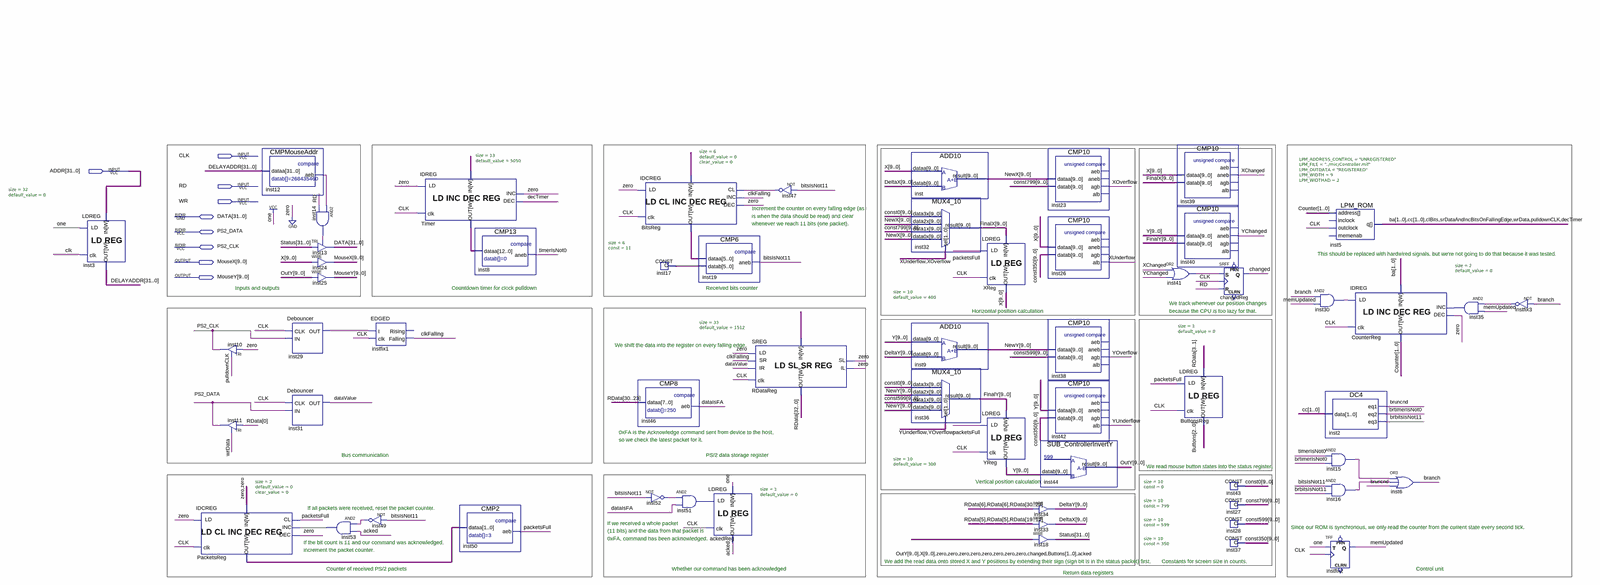
[diagram p0: schematic sheet, whole]
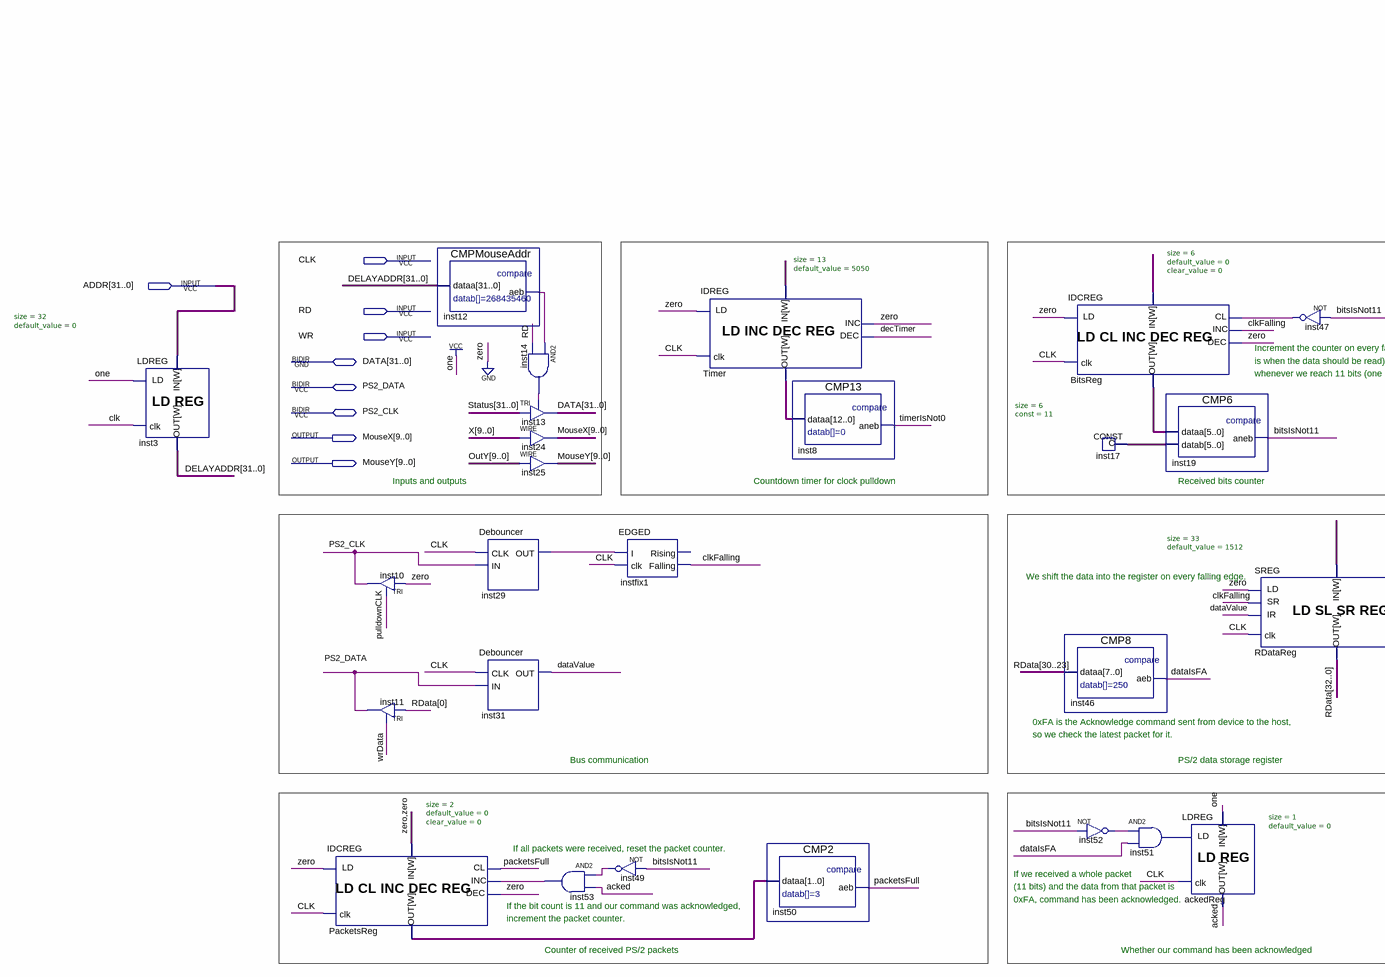
[diagram p1: schematic sheet, left part]
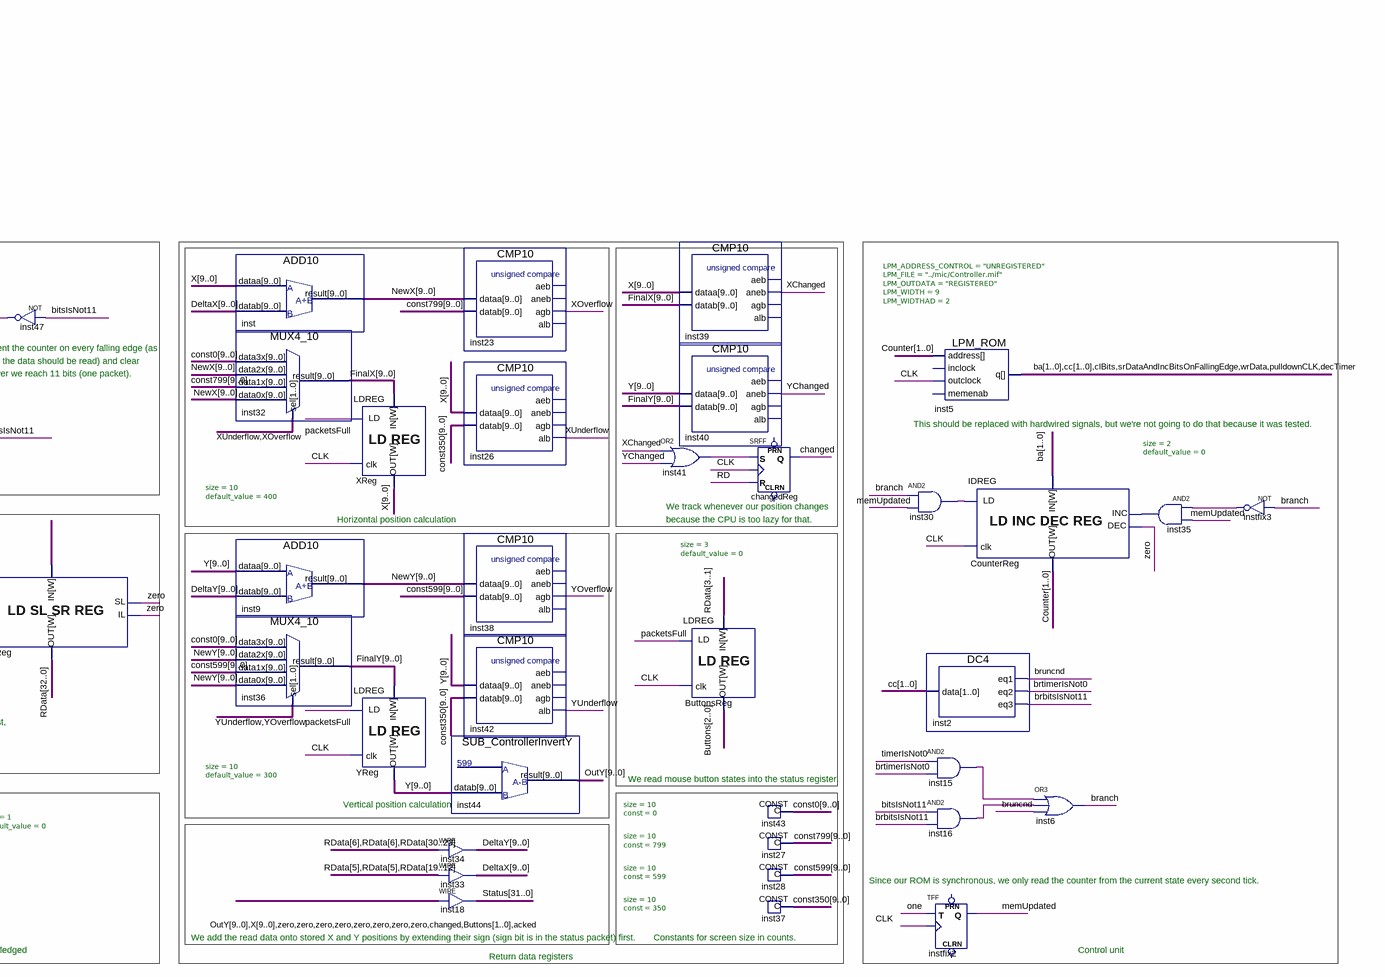
[diagram p2: schematic sheet, right part]
// Quartus schematic Controller.bdf as structural Verilog: 59 symbols, 9 pins
module Controller (
  input  CLK,
  input  [31:0] ADDR,
  input  RD,
  input  WR,
  inout  [31:0] DATA,
  inout  PS2_DATA,
  inout  PS2_CLK,
  output [9:0] MouseX,
  output [9:0] MouseY
);

  wire acked, bitsIsNot11, branch, brbitsIsNot11, brtimerIsNot0, bruncnd, changed, clBits, clkFalling,
       dataIsFA, dataValue, decTimer, inst12_aeb, inst14_out, inst15_out, inst16_out, inst29_o, inst30_out,
       inst35_out, inst41_out, inst47_out, inst49_out, inst51_out, inst52_out, inst53_out, instfix3_out,
       memUpdated, packetsFull, pulldownCLK, srDataAndIncBitsOnFallingEdge, timerIsNot0, wrData, XChanged,
       XOverflow, XUnderflow, YChanged, YOverflow, YUnderflow;
  wire [1:0] ba, cc, Counter, PacketsReg_data_out;
  wire [2:0] Buttons;
  wire [5:0] BitsReg_data_out, inst17_data;
  wire [9:0] const0, const350, const599, const799, DeltaX, DeltaY, FinalX, FinalY, NewX, NewY, OutY, X, Y;
  wire [12:0] Timer_data_out;
  wire [31:0] DELAYADDR, Status;
  wire [32:0] RData;

  LDREG #(.size(32), .default_value(0)) inst3 (.clk(CLK), .data_in(ADDR), .ld(1'b1), .data_out(DELAYADDR));
  IDCREG #(.size(2), .default_value(0), .clear_value(0)) PacketsReg (
    .clk(CLK), .data_in(2'b00), .cl(packetsFull), .inc(inst53_out), .dec(1'b0), .ld(1'b0),
    .data_out(PacketsReg_data_out));
  TRI inst10 (.IN(1'b0), .OE(pulldownCLK), .OUT(PS2_CLK));
  TRI inst11 (.IN(RData[0]), .OE(wrData), .OUT(PS2_DATA));
  CMPMouseAddr inst12 (.dataa(DELAYADDR), .aeb(inst12_aeb));
  Debouncer inst29 (.CLK(CLK), .I(PS2_CLK), .O(inst29_o));
  Debouncer inst31 (.CLK(CLK), .I(PS2_DATA), .O(dataValue));
  and inst14 (inst14_out, inst12_aeb, RD);
  TRI inst13[31:0] (.IN(Status), .OE(inst14_out), .OUT(DATA));
  assign MouseX = X;  // WIRE inst24
  assign MouseY = OutY;  // WIRE inst25
  and inst53 (inst53_out, inst49_out, acked);
  not inst49 (inst49_out, bitsIsNot11);
  EDGED instfix1 (.I(inst29_o), .clk(CLK), .Falling(clkFalling));  // open: Rising
  IDREG #(.size(13), .default_value(5050)) Timer (
    .clk(CLK), .data_in({13{1'b0}}), .inc(1'b0), .dec(decTimer), .ld(1'b0), .data_out(Timer_data_out));
  CMP13 inst8 (.dataa(Timer_data_out), .aneb(timerIsNot0));
  CMP2 inst50 (.dataa(PacketsReg_data_out), .aeb(packetsFull));
  IDCREG #(.size(6), .default_value(0), .clear_value(0)) BitsReg (
    .clk(CLK), .data_in({6{1'b0}}), .cl(inst47_out), .inc(clkFalling), .dec(1'b0), .ld(1'b0),
    .data_out(BitsReg_data_out));
  CMP8 inst46 (.dataa(RData[30:23]), .aeb(dataIsFA));
  CONST #(.size(6), .\const (11)) inst17 (.data(inst17_data));
  not inst52 (inst52_out, bitsIsNot11);
  CMP6 inst19 (.dataa(BitsReg_data_out), .datab(inst17_data), .aneb(bitsIsNot11));
  and inst51 (inst51_out, inst52_out, dataIsFA);
  LDREG #(.size(1), .default_value(0)) ackedReg (.clk(CLK), .data_in(1'b1), .ld(inst51_out), .data_out(acked));
  SREG #(.size(33), .default_value(1512)) RDataReg (
    .clk(CLK), .data_in({33{1'b0}}), .sl(1'b0), .il(1'b0), .ld(1'b0), .sr(clkFalling), .ir(dataValue),
    .data_out(RData));
  not inst47 (inst47_out, bitsIsNot11);
  ADD10 inst (.dataa(X), .datab(DeltaX), .result(NewX));
  MUX4_10 inst32 (
    .data3x(const0), .data2x(NewX), .data1x(const799), .data0x(NewX), .sel({XUnderflow, XOverflow}),
    .result(FinalX));
  ADD10 inst9 (.dataa(Y), .datab(DeltaY), .result(NewY));
  MUX4_10 inst36 (
    .data3x(const0), .data2x(NewY), .data1x(const599), .data0x(NewY), .sel({YUnderflow, YOverflow}),
    .result(FinalY));
  LDREG #(.size(10), .default_value(400)) XReg (.clk(CLK), .data_in(FinalX), .ld(packetsFull), .data_out(X));
  LDREG #(.size(10), .default_value(300)) YReg (.clk(CLK), .data_in(FinalY), .ld(packetsFull), .data_out(Y));
  assign DeltaY = {{2{RData[6]}}, RData[30:23]};  // WIRE inst34
  assign DeltaX = {{2{RData[5]}}, RData[19:12]};  // WIRE inst33
  assign Status = {OutY, X, {8{1'b0}}, changed, Buttons[1:0], acked};  // WIRE inst18
  CMP10 inst23 (.dataa(NewX), .datab(const799), .agb(XOverflow));  // open: aeb, aneb, alb
  CMP10 inst26 (.dataa(X), .datab(const350), .alb(XUnderflow));  // open: aeb, aneb, agb
  CMP10 inst38 (.dataa(NewY), .datab(const599), .agb(YOverflow));  // open: aeb, aneb, alb
  CMP10 inst42 (.dataa(Y), .datab(const350), .alb(YUnderflow));  // open: aeb, aneb, agb
  SUB_ControllerInvertY inst44 (.datab(Y), .result(OutY));
  CMP10 inst39 (.dataa(X), .datab(FinalX), .aneb(XChanged));  // open: aeb, agb, alb
  CMP10 inst40 (.dataa(Y), .datab(FinalY), .aneb(YChanged));  // open: aeb, agb, alb
  or inst41 (inst41_out, XChanged, YChanged);
  LDREG #(.size(3), .default_value(0)) ButtonsReg (
    .clk(CLK), .data_in(RData[3:1]), .ld(packetsFull), .data_out(Buttons));
  SRFF changedReg (.S(inst41_out), .R(RD), .CLK(CLK), .Q(changed));  // open: PRN, CLRN
  CONST #(.size(10), .\const (0)) inst43 (.data(const0));
  CONST #(.size(10), .\const (799)) inst27 (.data(const799));
  CONST #(.size(10), .\const (599)) inst28 (.data(const599));
  CONST #(.size(10), .\const (350)) inst37 (.data(const350));
  LPM_ROM #(.LPM_ADDRESS_CONTROL("UNREGISTERED"), .LPM_FILE("../mic/Controller.mif"), .LPM_OUTDATA("REGISTERED"), .LPM_WIDTH(9), .LPM_WIDTHAD(2)) inst5 (
    .address(Counter), .outclock(CLK),
    .q({ba, cc, clBits, srDataAndIncBitsOnFallingEdge, wrData, pulldownCLK, decTimer}));  // open: inclock, memenab
  and inst30 (inst30_out, branch, memUpdated);
  DC4 inst2 (.data(cc), .eq1(bruncnd), .eq2(brtimerIsNot0), .eq3(brbitsIsNot11));
  and inst15 (inst15_out, timerIsNot0, brtimerIsNot0);
  and inst16 (inst16_out, bitsIsNot11, brbitsIsNot11);
  TFF instfix2 (.T(1'b1), .CLK(CLK), .Q(memUpdated));  // open: PRN, CLRN
  IDREG #(.size(2), .default_value(0)) CounterReg (
    .clk(CLK), .data_in(ba), .inc(inst35_out), .dec(1'b0), .ld(inst30_out), .data_out(Counter));
  or inst6 (branch, inst15_out, inst16_out, bruncnd);
  and inst35 (inst35_out, instfix3_out, memUpdated);
  not instfix3 (instfix3_out, branch);

  // Notes on the sheet:
  //   Increment the counter on every falling edge (as
  //   is when the data should be read) and clear
  //   whenever we reach 11 bits (one packet).
  //   This should be replaced with hardwired signals, but we're not going to do that because it was tested.
  //   Inputs and outputs
  //   Countdown timer for clock pulldown
  //   Received bits counter
  //   We track whenever our position changes
  //   Horizontal position calculation
  //   because the CPU is too lazy for that.
  //   We shift the data into the register on every falling edge.
  //   0xFA is the Acknowledge command sent from device to the host,
  //   so we check the latest packet for it.
  //   Bus communication
  //   PS/2 data storage register
  //   We read mouse button states into the status register.
  //   Vertical position calculation
  //   If all packets were received, reset the packet counter.
  //   If we received a whole packet
  //   Since our ROM is synchronous, we only read the counter from the current state every second tick.
  //   (11 bits) and the data from that packet is
  //   0xFA, command has been acknowledged.
  //   If the bit count is 11 and our command was acknowledged,
  //   increment the packet counter.
  //   We add the read data onto stored X and Y positions by extending their sign (sign bit is in the status packet) first.
  //   Constants for screen size in counts.
  //   Counter of received PS/2 packets
  //   Whether our command has been acknowledged
  //   Control unit
  //   Return data registers
endmodule
